# Altium schematic sheet M8充电器.SchDoc
size A3
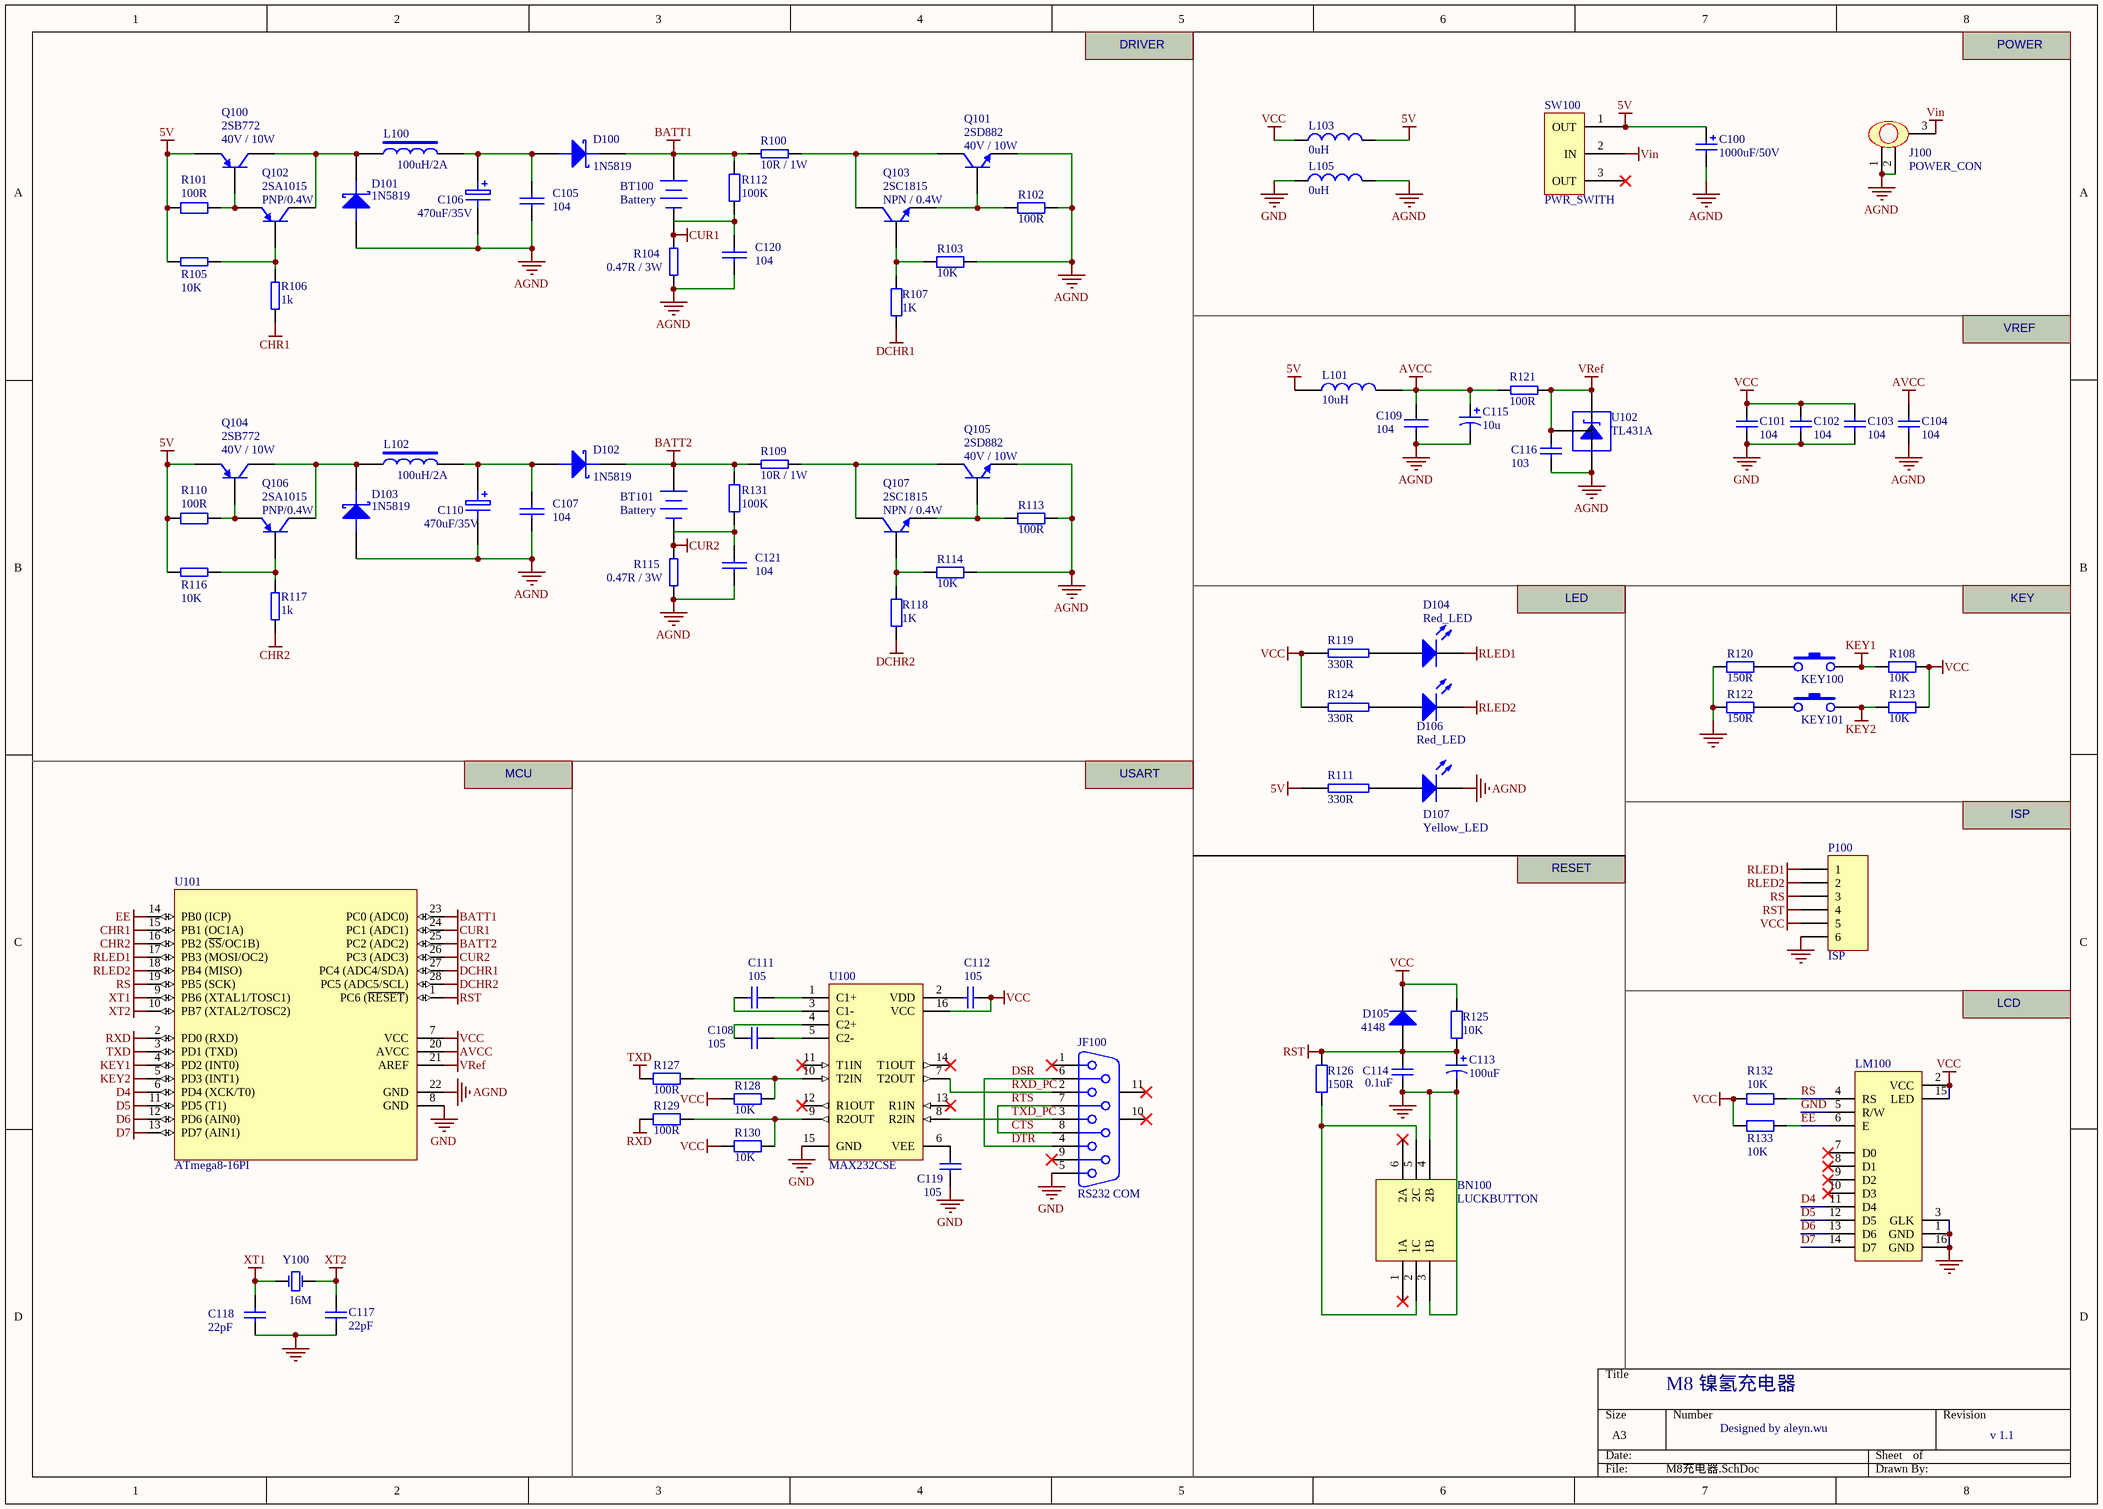
[diagram p0: M8充电器.SchDoc]

## Parts
BN100  LUCKBUTTON  [LBTN-01]
BT100  Battery  [BAT-2]
BT101  Battery  [BAT-2]
C100  1000uF/50V  [C1000uF/50V]
C101  104  [0805]
C102  104  [0805]
C103  104  [0805]
C104  104  [0805]
C105  104  [0805]
C106  470uF/35V  [C1000uF/16V]
C107  104  [0805]
C108  105  [0805]
C109  104  [0805]
C110  470uF/35V  [C1000uF/16V]
C111  105  [0805]
C112  105  [0805]
C113  100uF  [1210]
C114  0.1uF  [0805]
C115  10u  [C100UF/10V]
C116  103  [0805]
C117  22pF  [0805]
C118  22pF  [0805]
C119  105  [0805]
C120  104  [0805]
C121  104  [0805]
D100  1N5819  [IN5822]
D101  1N5819  [IN5822]
D102  1N5819  [IN5822]
D103  1N5819  [IN5822]
D104  Red_LED  [LED2]
D105  4148  [1206D]
D106  Red_LED  [LED2]
D107  Yellow_LED  [LED2]
J100  POWER_CON  [POWER_CON]
JF100  RS232 COM  [DSUB1.385-2H9]
KEY100  (no value)  [BUTTON1]
KEY101  (no value)  [BUTTON1]
L100  100uH/2A  [INDU20UH]
L101  10uH  [1206]
L102  100uH/2A  [INDU20UH]
L103  0uH  [RES_V1W]
L105  0uH  [RES_V1W]
LM100  TC1602  [HDR2X7]  (value not drawn)
P100  ISP  [HDR1X6]
Q100  2SB772  Publisher: 40V / 10W  [TO-262-AA]
Q101  2SD882  Published: 40V / 10W  [TO-262-AA]
Q102  2SA1015  Published: PNP/0.4W  [SOT-23/2]
Q103  2SC1815  Published: NPN / 0.4W  [SOT-23/2]
Q104  2SB772  Publisher: 40V / 10W  [TO-262-AA]
Q105  2SD882  Published: 40V / 10W  [TO-262-AA]
Q106  2SA1015  Published: PNP/0.4W  [SOT-23/2]
Q107  2SC1815  Published: NPN / 0.4W  [SOT-23/2]
R100  10R / 1W  [AXIAL-0.6]
R101  100R  [AXIAL-0.4]
R102  100R  [AXIAL-0.4]
R103  10K  [0805]
R104  0.47R / 3W  [AXIAL-0.7]
R105  10K  [0805]
R106  1k  [0805]
R107  1K  [0805]
R108  10K  [0805]
R109  10R / 1W  [AXIAL-0.6]
R110  100R  [AXIAL-0.4]
R111  330R  [0805]
R112  100K  [0805]
R113  100R  [AXIAL-0.4]
R114  10K  [0805]
R115  0.47R / 3W  [AXIAL-0.7]
R116  10K  [0805]
R117  1k  [0805]
R118  1K  [0805]
R119  330R  [0805]
R120  150R  [0805]
R121  100R  [0805]
R122  150R  [0805]
R123  10K  [0805]
R124  330R  [0805]
R125  10K  [0805]
R126  150R  [0805]
R127  100R  [0805]
R128  10K  [0805]
R129  100R  [0805]
R130  10K  [0805]
R131  100K  [0805]
R132  10K  [0805]
R133  10K  [0805]
SW100  PWR_SWITH  [POWER_SWITCH2]
U100  MAX232CSE  [SO-16]
U101  ATmega8-16PI  [32A_N]
U102  TL431A  [SOT-89]
Y100  16M  [XTAL]

## Nets
5V: C100.1 L101.1 L103.1 Q100.1(E) Q104.1(E) R101.1 R105.1 R110.1 R111.2 R116.1 SW100.1(OUT)
AGND: C100.2 C104.2 C105.2 C106.2 C107.2 C109.2 C110.2 C115.2 C116.1 C120.2 C121.2 D101.1(A) D103.1(A) D107.2(K) J100.1 J100.2 L105.1 Q101.1(E) Q105.1(E) R102.1 R103.1 R104.1 R113.1 R114.1 R115.1 U101.22(GND) U102.2
AVCC: C104.1 C109.1 C115.1 L101.2 R121.1 U101.20(AVCC)
BATT1: BT100.1(+) D100.2(K) R100.2 R112.1 U101.23(PC0_(ADC0))
BATT2: BT101.1(+) D102.2(K) R109.2 R131.1 U101.25(PC2_(ADC2))
CHR1: R106.2 U101.15(PB1_(OC1A))
CHR2: R117.2 U101.16(PB2_(~{SS}/OC1B))
CUR1: BT100.2(-) R104.2 U101.24(PC1_(ADC1))
CUR2: BT101.2(-) R115.2 U101.26(PC3_(ADC3))
D4: LM100.11(D4) U101.6(PD4_(XCK/T0))
D5: LM100.12(D5) U101.11(PD5_(T1))
D6: LM100.13(D6) U101.12(PD6_(AIN0))
D7: LM100.14(D7) U101.13(PD7_(AIN1))
DCHR1: R107.1 U101.27(PC4_(ADC4/SDA))
DCHR2: R118.1 U101.28(PC5_(ADC5/SCL))
EE: LM100.6(E) R133.2 U101.14(PB0_(ICP))
GND: BN100.3(1B) BN100.4(2B) C101.1 C102.1 C103.2 C113.2 C114.2 C117.2 C118.2 C119.1 JF100.5 L105.2 LM100.1(GND) LM100.3(GLK) LM100.5(R/W) LM100.16(GND) P100.6 R120.2 R122.2 U100.15(GND) U101.8(GND)
KEY1: KEY100.2 R108.2 U101.4(PD2_(INT0))
KEY2: KEY101.2 R123.2 U101.5(PD3_(INT1))
RLED1: D104.2(K) P100.1 U101.17(PB3_(MOSI/OC2))
RLED2: D106.2(K) P100.2 U101.18(PB4_(MISO))
RS: LM100.4(RS) P100.3 R132.2 U101.19(PB5_(SCK))
RST: C113.1 C114.1 D105.1(A) P100.4 R125.2 R126.2 U101.1(PC6_(~{RESET}))
RXD: R129.1 U101.2(PD0_(RXD))
TXD: R127.1 U101.3(PD1_(TXD))
VCC: C101.2 C102.2 C103.1 C112.2 D105.2(K) L103.2 LM100.2(VCC) LM100.15(LED) P100.5 R108.1 R119.2 R123.1 R124.2 R125.1 R128.1 R130.2 R132.1 R133.1 U100.16(VCC) U101.7(VCC)
Vin: J100.3 SW100.2(IN)
VRef: C116.2 R121.2 U101.21(AREF) U102.1 U102.3
XT1: C118.1 U101.9(PB6_(XTAL1/TOSC1)) Y100.1(OSC1)
XT2: C117.1 U101.10(PB7_(XTAL2/TOSC2)) Y100.2(OSC2)
CTS: JF100.7 JF100.8  [also labelled RTS]
DSR: JF100.4 JF100.6  [also labelled DTR]
RXD_PC: JF100.2 U100.7(T2OUT)
TXD_PC: JF100.3 U100.8(R2IN)
NetBN100_2: BN100.2(1C) BN100.5(2C) R126.1
NetC105_1: C105.1 C106.1 D100.1(A) L100.2
NetC107_1: C107.1 C110.1 D102.1(A) L102.2
NetC108_1: C108.1 U100.4(C2+)
NetC108_2: C108.2 U100.5(C2-)
NetC111_1: C111.1 U100.3(C1-)
NetC111_2: C111.2 U100.1(C1+)
NetC112_1: C112.1 U100.2(VDD)
NetC119_2: C119.2 U100.6(VEE)
NetC120_1: C120.1 R112.2
NetC121_1: C121.1 R131.2
NetD101_2: D101.2(K) L100.1 Q100.3(C) Q102.3(C)
NetD103_2: D103.2(K) L102.1 Q104.3(C) Q106.3(C)
NetD104_1: D104.1(A) R119.1
NetD106_1: D106.1(A) R124.1
NetD107_1: D107.1(A) R111.1
NetKEY100_1: KEY100.1 R120.1
NetKEY101_1: KEY101.1 R122.1
NetQ100_2: Q100.2(B) Q102.1(E) R101.2
NetQ101_2: Q101.2(B) Q103.1(E) R102.2
NetQ101_3: Q101.3(C) Q103.3(C) R100.1
NetQ102_2: Q102.2(B) R105.2 R106.1
NetQ103_2: Q103.2(B) R103.2 R107.2
NetQ104_2: Q104.2(B) Q106.1(E) R110.2
NetQ105_2: Q105.2(B) Q107.1(E) R113.2
NetQ105_3: Q105.3(C) Q107.3(C) R109.1
NetQ106_2: Q106.2(B) R116.2 R117.1
NetQ107_2: Q107.2(B) R114.2 R118.2
NetR127_2: R127.2 R128.2 U100.10(T2IN)
NetR129_2: R129.2 R130.1 U100.9(R2OUT)

Not connected (* = marked no-connect by the designer): BN100 1(1A)* 6(2A)*; JF100 1* 9* 10(MH1)* 11(MH2)*; LM100 7(D0)* 8(D1)* 9(D2)* 10(D3)*; SW100 3(OUT)*; U100 11(T1IN)* 12(R1OUT)* 13(R1IN)* 14(T1OUT)*

## Notes on the sheet
- DRIVER
- POWER
- VREF
- LED
- KEY
- MCU
- USART
- ISP
- RESET
- LCD
- M8 镍氢充电器
- Designed by aleyn.wu
- v 1.1

## Library data of the parts
BT100 BT101 = Battery: Multicell Battery; Published: 24-Mar-1999; LatestRevisionDate: 17-Jul-2002; LatestRevisionNote: Re-released for DXP Platform.; PackageReference: BAT-2; Publisher: Altium Limited
C100 = Cap Pol1: Polarized Capacitor (Radial); Manufacturer: Generic Components; Class: Passive; Published: 08/06/2000; Publisher: Altium Hobart Technology Centre; SubClass: Capacitor; Value: 1000uF/50V
C101-C103 C116-C118 = Cap: Capacitor; Value: 0.1uF; Published: 8-Jun-2000; LatestRevisionDate: 17-Jul-2002; LatestRevisionNote: Re-released for DXP Platform.; PackageReference: RAD-0.3; Publisher: Altium Limited
C104 = Cap: Capacitor; Manufacturer: Generic Components; Class: Passive; Published: 08/06/2000; Publisher: Altium Hobart Technology Centre; SubClass: Capacitor; Value: 104
C105 C107 C120 C121 = CAP: Capacitor
C106 C110 = ELECTRO1: Electrolytic Capacitor
C108 C111 C112 C119 = Cap: Capacitor; Manufacturer: Generic Components; Class: Passive; Value: 104; Published: 08/06/2000; Publisher: Altium Hobart Technology Centre; SubClass: Capacitor
C109 = CAP: Text Field1: 20; Text Field2: 10
C113 C115 = Cap Pol1: Polarized Capacitor (Radial); Value: 10uF; Published: 8-Jun-2000; LatestRevisionDate: 17-Jul-2002; LatestRevisionNote: Re-released for DXP Platform.; PackageReference: RB7.6-15; Publisher: Altium Limited
C114 = Cap: Capacitor; Published: 8-Jun-2000; LatestRevisionDate: 17-Jul-2002; LatestRevisionNote: Re-released for DXP Platform.; PackageReference: RAD-0.3; Publisher: Altium Limited; Value: 0.1uF
D100-D103 = DIODE SCHOTTKY: Schottky Diode
D104 D106 D107 = LED0: Typical INFRARED GaAs LED; Published: 8-Jun-2000; LatestRevisionDate: 08-Jul-2005; LatestRevisionNote: Mech Layer 1 removed.; PackageReference: LED-0; Publisher: Altium Limited
D105 = Diode 1N4001: 1 Amp General Purpose Rectifier; Published: 8-Jun-2000; LatestRevisionDate: 17-Jul-2002; LatestRevisionNote: Re-released for DXP Platform.; DatasheetDocument: 1998; PackageDocument: Aug-1999; PackageReference: DO-41; Publisher: Altium Limited; Code_JEDEC: DO-204-AL; ComponentLink1Description: Manufacturer Link; ComponentLink1URL: http://www.fairchildsemi.com/; ComponentLink2Description: Datasheet; ComponentLink2URL: http://www.fairchildsemi.com/ds/1N%2F1N4001.pdf
J100 = POWER_CON: Power Connect
JF100 = RS232 COM: Manufacturer: Generic Components; Class: Connector; Positions: 9; Gender: Receptacle; Published: 15/06/2001; Publisher: Altium Hobart Technology Centre; Orientation: Right Angle
KEY100 KEY101 = SW-PB
L100 L102 = INDUCTOR2
L101 = INDUCTOR
L103 L105 = Inductor: Manufacturer: Generic Components; Class: Passive; Value: 330uH; Published: 08/06/2000; Publisher: Altium Hobart Technology Centre; SubClass: Inductor
LM100 = TC1602B: LCD TC1602B
P100 = Header 6: Header, 6-Pin; LatestRevisionDate: 17-Jul-2002; LatestRevisionNote: Re-released for DXP Platform.; Publisher: Altium Limited
Q100 Q102 Q104 Q106 = 2N3906: PNP General Purpose Amplifier; LatestRevisionDate: 15-Jan-2003; LatestRevisionNote: PCB Footprint 'BCY-W3/D4.7' replaced; DatasheetDocument: 1997; PackageDocument: Sep-1998; PackageReference: TO-92A; Code_JEDEC: TO-92A; ComponentLink1Description: Manufacturer Link; ComponentLink1URL: http://www.fairchildsemi.com/; ComponentLink2Description: Datasheet; ComponentLink2URL: http://www.fairchildsemi.com/ds/2N%2F2N3906.pdf
  Q100 Q104: Published: 8-Jun-2000
  Q102 Q106: Publisher: Altium Limited
Q101 Q103 Q105 Q107 = 2N3904: NPN General Purpose Amplifier; LatestRevisionDate: 15-Jan-2003; LatestRevisionNote: PCB Footprint 'BCY-W3/D4.7' replaced; DatasheetDocument: 1997; PackageDocument: Sep-1998; PackageReference: TO-92A; Publisher: Altium Limited; Code_JEDEC: TO-92A; ComponentLink1Description: Manufacturer Link; ComponentLink1URL: http://www.fairchildsemi.com/; ComponentLink2Description: Datasheet; ComponentLink2URL: http://www.fairchildsemi.com/ds/2N%2F2N3904.pdf
R100 R104-R106 R109 R115-R117 R121 = RES5
R101 R102 R110 R113 R125-R127 R129 R132 R133 = Res2: Resistor; Value: 1K; Published: 8-Jun-2000; LatestRevisionDate: 17-Jul-2002; LatestRevisionNote: Re-released for DXP Platform.; PackageReference: AXIAL-0.4; Publisher: Altium Limited
R103 R107 R108 R114 R118 R123 R128 R130 = Res2: Resistor; Published: 8-Jun-2000; LatestRevisionDate: 17-Jul-2002; LatestRevisionNote: Re-released for DXP Platform.; PackageReference: AXIAL-0.4; Publisher: Altium Limited
  R103 R108 R114 R123 R128 R130: Value: 10K
  R107 R118: Value: 1K
R111 R119 R124 = RES2
R112 R120 R122 R131 = Res2: Resistor; Value: 10K; Published: 8-Jun-2000; LatestRevisionDate: 17-Jul-2002; LatestRevisionNote: Re-released for DXP Platform.; PackageReference: AXIAL-0.4; Publisher: Altium Limited
SW100 = PWR_SWITH: Power Switch
U100 = MAX232CPE: +5V Powered RS-232 Driver/Receiver; Manufacturer: Maxim; Class: Communication; SubClass: Transceiver; Published: 16/01/2001; Publisher: Altium Hobart Technology Centre
U101 = ATmega8-16PI: 8-Bit AVR Microcontroller with 8K Bytes of In-System Programmable Flash Memory; PackageDocument: revB, Sep-2001; Published: 17-Sep-2003; LatestRevisionDate: 4-Mar-2005; LatestRevisionNote: Stylized 3D Model Added.; DatasheetDocument: 2486H-AVR-09/02; PackageReference: 28P3; Publisher: Altium Limited; ComponentLink1Description: Manufacturer Link; ComponentLink1URL: http://www.atmel.com; ComponentLink2Description: Datasheet; ComponentLink2URL: http://www.atmel.com/dyn/resources/prod_documents/doc2486.pdf
U102 = TL431
Y100 = XTAL: Crystal Oscillator; Manufacturer: Generic Components; Published: 08/06/2000; Publisher: Altium Hobart Technology Centre; Class: Oscillator; SubClass: Crystal Oscillator